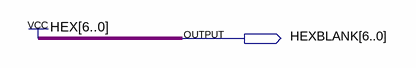
[diagram p0: schematic sheet]
// Quartus schematic Blank.bdf as structural Verilog: 0 symbols, 1 pins
module Blank (
  output [6:0] HEXBLANK
);


  assign HEXBLANK = {7{1'b1}};
endmodule
